# Altium project Samba2_Remote.PrjPcb
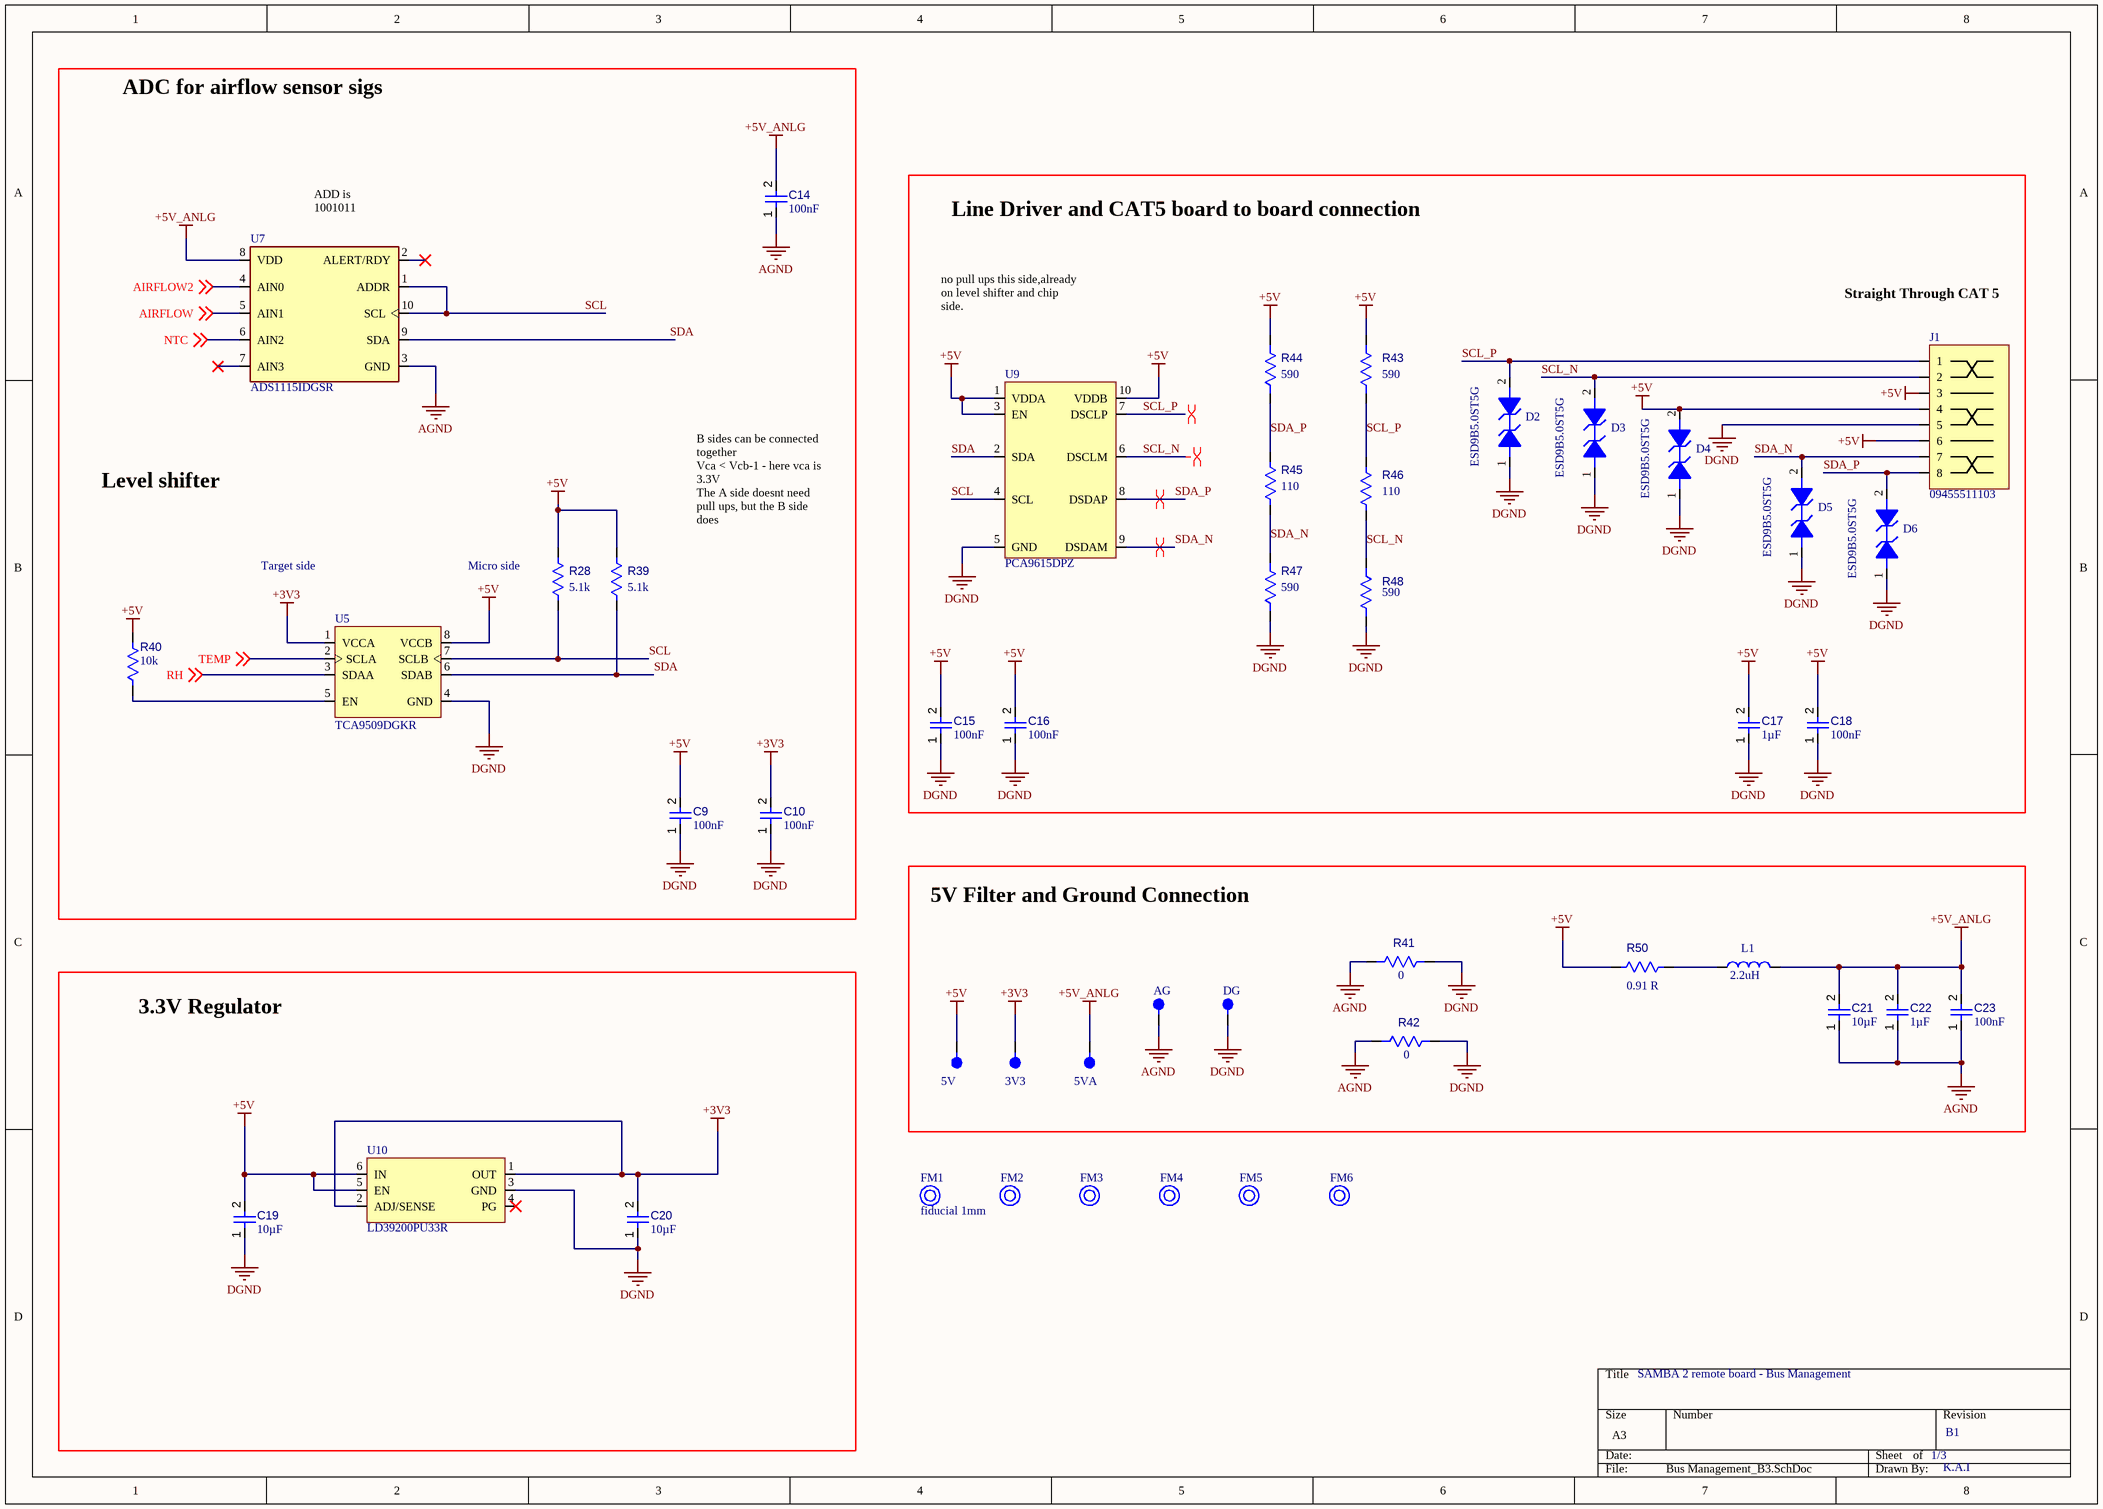
[diagram p0: Bus Management_B3.SchDoc]
Revision: B1
3 sheets, 95 parts. Net scope: global (net labels, ports and power ports of the same name join across sheets).
Board files: Remote Rev B3.PcbDoc, PCB1.PcbDoc
Sheets:
  Bus Management_B3.SchDoc
  Airspeed2_B3.SchDoc
  Airspeed1_B3.SchDoc

## Sheet Bus Management_B3.SchDoc
size A3; SheetNumber: 1; SheetTotal: 3

### Parts
3V3  PH1-01-UA  [FP-PH1-01-UA-MFG]  (value not drawn)  (no BOM)
5V  PH1-01-UA  [FP-PH1-01-UA-MFG]  (value not drawn)  (no BOM)
5VA  PH1-01-UA  [FP-PH1-01-UA-MFG]  (value not drawn)  (no BOM)
AG  PH1-01-UA  [FP-PH1-01-UA-MFG]  (value not drawn)  (no BOM)
C9  value 100nF  [MANUF_CAP_0603]  (hidden comment: CC0603KRX7R7BB104)
C10  value 100nF  [MANUF_CAP_0603]  (hidden comment: CC0603KRX7R7BB104)
C14  value 100nF  [MANUF_CAP_0603]  (hidden comment: CC0603KRX7R7BB104)
C15  value 100nF  [MANUF_CAP_0603]  (hidden comment: CC0603KRX7R7BB104)
C16  value 100nF  [MANUF_CAP_0603]  (hidden comment: CC0603KRX7R7BB104)
C17  value 1µF  [MANUF_CAP_0603]  (hidden comment: CL10B105KA8NFNC)
C18  value 100nF  [MANUF_CAP_0603]  (hidden comment: CC0603KRX7R7BB104)
C19  value 10µF  [FP-CL21B106KOQNNNE-IPC_A]  (hidden comment: CL21B106KOQNNNE)
C20  value 10µF  [FP-CL21B106KOQNNNE-IPC_A]  (hidden comment: CL21B106KOQNNNE)
C21  value 10µF  [FP-GRM188-0_15-MFG]  (hidden comment: GRM188R61A106ME69D)
C22  value 1µF  [MANUF_CAP_0603]  (hidden comment: CL10B105KA8NFNC)
C23  value 100nF  [MANUF_CAP_0603]  (hidden comment: CC0603KRX7R7BB104)
D2  ESD9B5.0ST5G  [ONSC-SOD-923-2-514AB-01_V]
D3  ESD9B5.0ST5G  [ONSC-SOD-923-2-514AB-01_V]
D4  ESD9B5.0ST5G  [ONSC-SOD-923-2-514AB-01_V]
D5  ESD9B5.0ST5G  [ONSC-SOD-923-2-514AB-01_V]
D6  ESD9B5.0ST5G  [ONSC-SOD-923-2-514AB-01_V]
DG  PH1-01-UA  [FP-PH1-01-UA-MFG]  (value not drawn)  (no BOM)
FM1  fiducial 1mm  [fiducial 1mm-Footprint-1]  (no BOM)
FM2  fiducial 1mm  [fiducial 1mm-Footprint-1]  (value not drawn)  (no BOM)
FM3  fiducial 1mm  [fiducial 1mm-Footprint-1]  (value not drawn)  (no BOM)
FM4  fiducial 1mm  [fiducial 1mm-Footprint-1]  (value not drawn)  (no BOM)
FM5  fiducial 1mm  [fiducial 1mm-Footprint-1]  (value not drawn)  (no BOM)
FM6  fiducial 1mm  [fiducial 1mm-Footprint-1]  (value not drawn)  (no BOM)
J1  09455511103  [09455511103-Footprint-1]
L1  value 2.2uH  [INDC3225X06N]  (hidden comment: CC322522A-2R2K)
R28  value 5.1k  [0805]  (hidden comment: RC0805JR-075K1L)
R39  value 5.1k  [0805]  (hidden comment: RC0805JR-075K1L)
R40  value 10k  [MANUF_RES_0603]  (hidden comment: RC0603FR-0710KL)
R41  value 0  [MANUF_RES_0603]  (hidden comment: Resistor 0R +/- 5% 0603 100 mW)
R42  value 0  [MANUF_RES_0603]  (hidden comment: Resistor 0R +/- 5% 0603 100 mW)
R43  value 590  [MANUF_RES_0603]  (hidden comment: ERJ-3EKF5900V)
R44  value 590  [MANUF_RES_0603]  (hidden comment: ERJ-3EKF5900V)
R45  value 110  [MANUF_RES_0603]  (hidden comment: RMCF0603FT110R)
R46  value 110  [MANUF_RES_0603]  (hidden comment: RMCF0603FT110R)
R47  value 590  [MANUF_RES_0603]  (hidden comment: ERJ-3EKF5900V)
R48  value 590  [MANUF_RES_0603]  (hidden comment: ERJ-3EKF5900V)
R50  value 0.91 R  [RESC3116X06N]  (hidden comment: CRM1206-FX-R910ELF)
U5  TCA9509DGKR  [TSOP65P490X110-8N]
U7  ADS1115IDGSR  [FP-DGS0010A-MFG]
U9  PCA9615DPZ  [TSSOP50P490X110-10N]
U10  LD39200PU33R  [FP-DFN6-7946637-MFG]

### Blocks framed on the sheet
Line Driver and CAT5 board to board connection: C15-C18 D2-D6 J1 R43-R48 U9
5V Filter and Ground Connection: 3V3 5V 5VA AG C21-C23 DG L1 R41 R42 R50
3.3V Regulator: C19 C20 U10

### Nets
+3V3: 3V3.1 C10.2 C20.2 U5.1(VCCA) U10.1(OUT) U10.2(ADJ/SENSE)
+5V: 5V.1 C9.2 C15.2 C16.2 C17.2 C18.2 C19.2 D4.2(A2) J1.3 J1.4 J1.6 R28.2 R39.2 R40.2 R43.2 R44.2 R50.1 U5.8(VCCB) U9.1(VDDA) U9.3(EN) U9.10(VDDB) U10.5(EN) U10.6(IN)
+5V_ANLG: 5VA.1 C14.2 C21.2 C22.2 C23.2 L1.2 U7.8(VDD)
AGND: AG.1 C14.1 C21.1 C22.1 C23.1 R41.1 R42.1 U7.3(GND)
DGND: C9.1 C10.1 C15.1 C16.1 C17.1 C18.1 C19.1 C20.1 D2.1(A1) D3.1(A1) D4.1(A1) D5.1(A1) D6.1(A1) DG.1 J1.5 R41.2 R42.2 R47.1 R48.1 U5.4(GND) U9.5(GND) U10.3(GND)
AIRFLOW: U7.5(AIN1) ; off-sheet AIRFLOW
AIRFLOW2: U7.4(AIN0) ; off-sheet AIRFLOW2
NTC: U7.6(AIN2) ; off-sheet NTC
RH: U5.3(SDAA) ; off-sheet RH
SCL: R28.1 U5.7(SCLB) U7.1(ADDR) U7.10(SCL) U9.4(SCL)
SCL_N: D3.2(A2) J1.2 R46.1 R48.2 U9.6(DSCLM)
SCL_P: D2.2(A2) J1.1 R43.1 R46.2 U9.7(DSCLP)
SDA: R39.1 U5.6(SDAB) U7.9(SDA) U9.2(SDA)
SDA_N: D5.2(A2) J1.7 R45.1 R47.2 U9.9(DSDAM)
SDA_P: D6.2(A2) J1.8 R44.1 R45.2 U9.8(DSDAP)
TEMP: U5.2(SCLA) ; off-sheet TEMP
NetL1_1: L1.1 R50.2
NetR40_1: R40.1 U5.5(EN)

Not connected (* = marked no-connect by the designer): U7 2(ALERT/RDY)* 7(AIN3)*; U10 4(PG)*

### Layout directives
differential pair: SCL_N, SCL_P, SDA_N, SDA_P

### Notes on the sheet
- ADC for airflow sensor sigs
- (near U7) ADD is
  1001011
- no pull ups this side,already on level shifter and chip side.
- Straight Through CAT 5
- Level shifter
- Target side
- (near R28) Micro side
- B sides can be connected together
  Vca < Vcb-1 - here vca is 3.3V
  The A side doesnt need pull ups, but the B side does
- SAMBA 2 remote board - Bus Management
- 1/3
- B1
- K.A.I

### Library data of the parts
3V3 5V 5VA AG DG = CMP-002-00083-1: Conn Unshrouded Header HDR 1 POS 2.54mm Solder ST Thru-Hole Bag
C9 C10 C14-C16 C18 C23 = CMP-001-00099-4: Ceramic Capacitor, Multilayer, Ceramic, 16V, 10% +Tol, 10% -Tol, X7R, 15% TC, 0.1uF, Surface Mount, 0603; Pins: 2; Min Operating Temperature: -55°C; Max Operating Temperature: 125°C; Case/Package: 0603; RoHS Compliant: Yes; Mounting Technology: Surface Mount; Capacitor Type: Ceramic
C17 C22 = CMP-001-00098-2: Ceramic Capacitor, Multilayer, Ceramic, 25V, 10% +Tol, 10% -Tol, X7R, 15% TC, 1uF, Surface Mount, 0603; Pins: 2; Mounting Technology: Surface Mount; Min Operating Temperature: -55°C; Case/Package: 0603; Capacitor Type: Ceramic; RoHS Compliant: Yes; Max Operating Temperature: 125°C
C19 C20 = CMP-001-00101-1: Ceramic Capacitor, Multilayer, Ceramic, 16V, 10% +Tol, 10% -Tol, X7R, 15% TC, 10uF, Surface Mount, 0805; RoHS Compliant: Yes; Max Operating Temperature: 125°C; Capacitor Type: Ceramic; Pins: 2; Min Operating Temperature: -55°C; Case/Package: 0805; Mounting Technology: Surface Mount
C21 = CMP-001-00097-1: Ceramic Capacitor, Multilayer, Ceramic, 10V, 20% +Tol, 20% -Tol, X5R, 15% TC, 10uF, Surface Mount, 0603; Min Operating Temperature: -55°C; RoHS Compliant: Yes; Pins: 2; Capacitor Type: Ceramic; Max Operating Temperature: 85°C; Mounting Technology: Surface Mount; Case/Package: 0603
D2-D6 = CMP-004-00032-1: Trans Voltage Suppressor Diode, 5V V(RWM), Bidirectional, 1 Element, Silicon; Pins: 2; Max Operating Temperature: 150°C; RoHS Compliant: Yes; Min Operating Temperature: -55°C
FM1-FM6 = CMP-00030-00004-9: fiducial marker 2D
J1 = CMP-002-00071-6: Telecom and Datacom Connector, 8 Contact(s), Female, Straight, Solder Terminal, Locking, Jack; Mounting Technology: Board; RoHS Compliant: Yes; Max Operating Temperature: 70°C; Min Operating Temperature: -40°C; Connector Type: TELECOM AND DATACOM CONNECTOR
L1 = CMP-006-00022-2: General Purpose Inductor, 2.2uH, 10%, 1 Element, Ferrite-Core, SMD, 1110; RoHS Compliant: Yes
R28 R39 = CMP-009-00191-2: Fixed Resistor, Metal Glaze/thick Film, 0.125W, 5100ohm, 150V, 5% +/-Tol, 100ppm/Cel, Surface Mount, 0805; Power: 125mW; Min Operating Temperature: -55°C; Case/Package: 0805; Pins: 2; Max Operating Temperature: 155°C; Tolerance: 5%; Mounting Technology: Surface Mount; RoHS Compliant: Yes
R40 = CMP-009-00204-2: Fixed Resistor, Metal Glaze/thick Film, 0.1W, 10000ohm, 75V, 1% +/-Tol, 100ppm/Cel, Surface Mount, 0603; Power: 100mW; Pins: 2; Max Operating Temperature: 155°C; Case/Package: 0603; RoHS Compliant: Yes; Tolerance: 1%; Min Operating Temperature: -55°C; Mounting Technology: Surface Mount
R41 R42 = CMP-009-00006-8: Chip Resistor, 0 Ohm, 0.1 W, -55 to 155 degC, 0603 (1608 Metric); Power: 100mW; Voltage Rating: 50V; Max Operating Temperature: 155°C; RoHS Compliant: True; Mounting Technology: SM; Case/Package: 0603; Min Operating Temperature: -55°C; Tolerance: 5%; Pins: 2
R43 R44 R47 R48 = CMP-009-00193-4: Fixed Resistor, Metal Glaze/thick Film, 0.1W, 590ohm, 75V, 1% +/-Tol, 100ppm/Cel, Surface Mount, 0603; Power: 100mW; Tolerance: 1%; Pins: 2; Mounting Technology: Surface Mount; Max Operating Temperature: 155°C; Min Operating Temperature: -55°C; RoHS Compliant: Yes; Case/Package: 0603
R45 R46 = CMP-009-00194-4: Fixed Resistor, Metal Glaze/thick Film, 0.1W, 110ohm, 75V, 1% +/-Tol, 100ppm/Cel, Surface Mount, 0603; Power: 100mW; Tolerance: 1%; Min Operating Temperature: -55°C; Case/Package: 0603; RoHS Compliant: Yes; Pins: 2; Mounting Technology: Surface Mount; Max Operating Temperature: 155°C
R50 = CMP-009-00211-1: Fixed Resistor, Metal Glaze/thick Film, 0.5W, 0.91ohm, 0.675V, 1% +/-Tol, 100ppm/Cel, Surface Mount, 1206; Power: 500mW; Mounting Technology: Surface Mount; RoHS Compliant: Yes; Min Operating Temperature: -55°C; Pins: 2; Case/Package: 1206; Tolerance: 1%; Max Operating Temperature: 155°C
U5 = CMP-00024-00006-2: Interface Circuit, PDSO8; Pins: 8; Case/Package: TSSOP; Min Operating Temperature: -40°C; RoHS Compliant: Yes; Max Operating Temperature: 85°C
U7 = CMP-015-00008-1: ADC, Delta-Sigma, 16-Bit, 1 Func, 4 Channel, Serial Access, PDSO10; Nominal Supply Voltage: 3.3V; Min Operating Temperature: -40°C; Max Operating Temperature: 125°C; RoHS Compliant: Yes; Case/Package: TSSOP; Pins: 10
U9 = CMP-00024-00007-3: IC Redriver I2C 2CH 10TSSOP
U10 = CMP-019-00050-2: Fixed Positive LDO Regulator, 3.3V, 0.25V Dropout; Max Supply Voltage: 6V; Case/Package: HVSON; Pins: 6; RoHS Compliant: Yes

## Sheet Airspeed2_B3.SchDoc
size A3; SheetNumber: 2; SheetTotal: 3
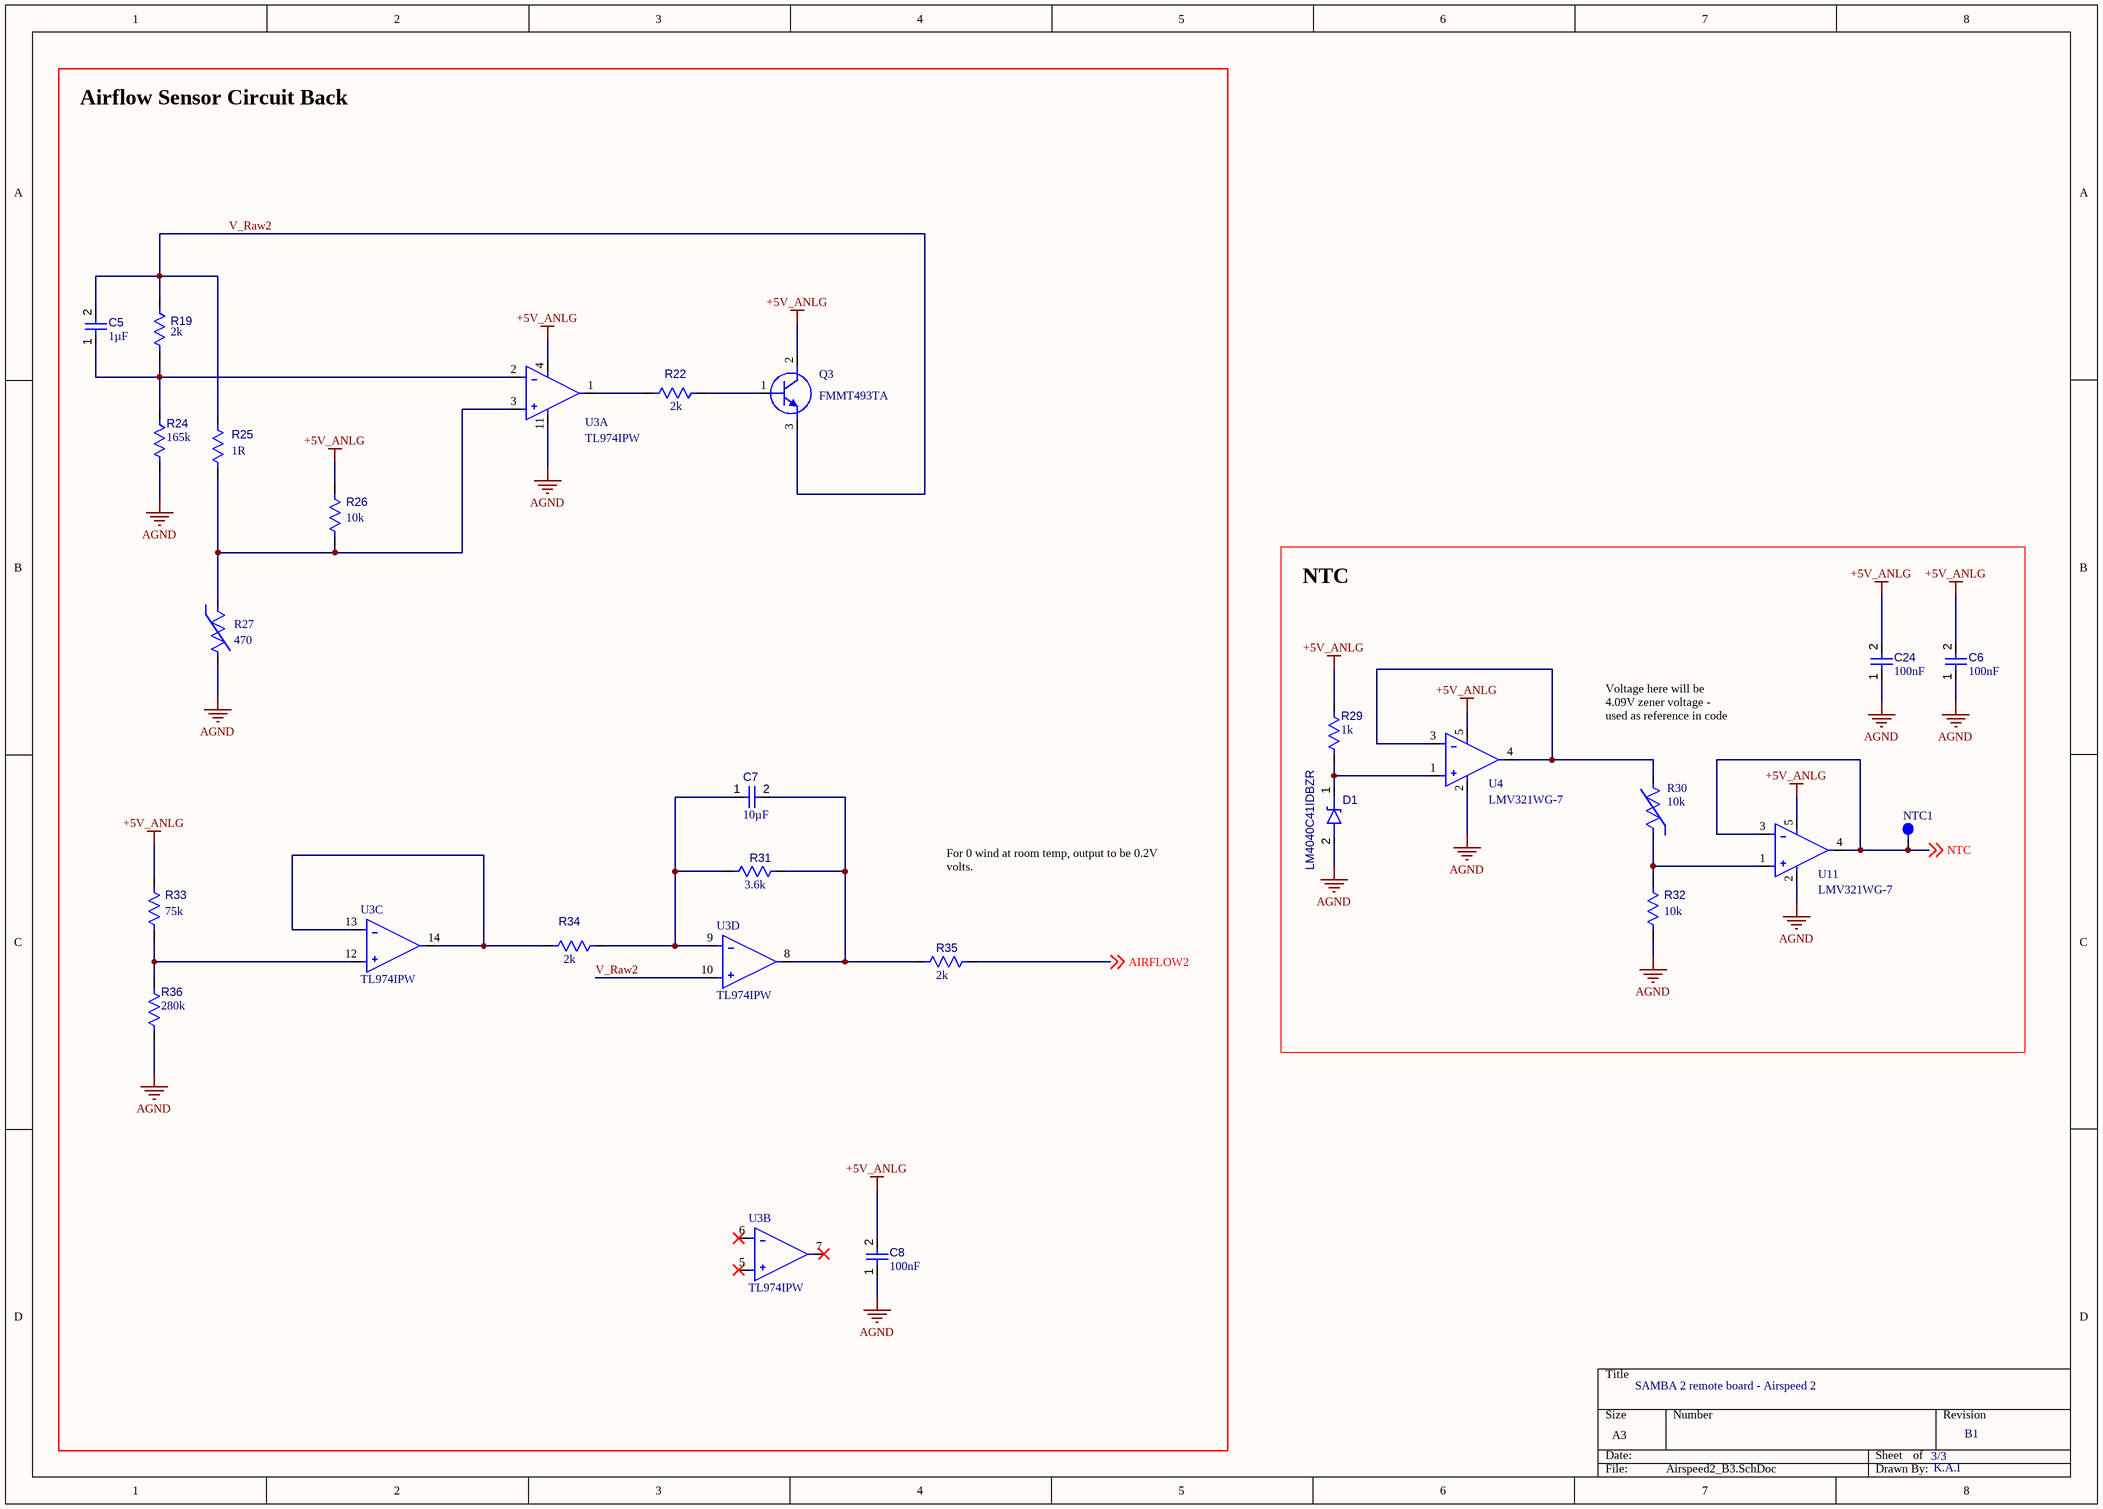
[diagram p1: Airspeed2_B3.SchDoc]

### Parts
C5  value 1µF  [MANUF_CAP_0603]  (hidden comment: CL10B105KA8NFNC)
C6  value 100nF  [MANUF_CAP_0603]  (hidden comment: CC0603KRX7R7BB104)
C7  value 10µF  [FP-GRM188-0_15-MFG]  (hidden comment: GRM188R61A106ME69D)
C8  value 100nF  [MANUF_CAP_0603]  (hidden comment: CC0603KRX7R7BB104)
C24  value 100nF  [MANUF_CAP_0603]  (hidden comment: CC0603KRX7R7BB104)
D1  LM4040C41IDBZR  [DBZ0003A_M]
NTC1  PH1-01-UA  [FP-PH1-01-UA-MFG]  (value not drawn)  (no BOM)
Q3  FMMT493TA  [SOT95P237X110-3N]
R19  value 2k  [MANUF_RES_0603]  (hidden comment: ERJ-3EKF2001V)
R22  value 2k  [MANUF_RES_0603]  (hidden comment: ERJ-3EKF2001V)
R24  value 165k  [RESC1608X55X30NL15T15]  (hidden comment: ERJ-3EKF1653V)
R25  value 1R  [Vishay_CRCW0805-HPe3_MFG]  (hidden comment: CRCW08051R00FKEAHP)
R26  value 10k  [MANUF_RES_0603]  (hidden comment: RC0603FR-0710KL)
R27  value 470  [NTCG103NH471JT1-Footprint-1]  (hidden comment: NTCG103NH471JT1)
R29  value 1k  [RESC1608X55X25ML10T15]  (hidden comment: Resistor 1k +/-1% 0603 100 mW)
R30  value 10k  [TT7-10KC3-11-Footprint-1]  (hidden comment: TT7-10KC3-11)
R31  value 3.6k  [RESC1609X50X30NL08T20]  (hidden comment: CRCW06033K60FKEAC)
R32  value 10k  [MANUF_RES_0603]  (hidden comment: RC0603FR-0710KL)
R33  value 75k  [IPC B 0603 RES]  (hidden comment: AC0603FR-0775KL)
R34  value 2k  [MANUF_RES_0603]  (hidden comment: ERJ-3EKF2001V)
R35  value 2k  [MANUF_RES_0603]  (hidden comment: ERJ-3EKF2001V)
R36  value 280k  [IPC B 0603 RES]  (hidden comment: RC0603FR-07280KL)
U3  TL974IPW  [TSOP65P640X120-14N]  (parts A,B,C,D of 4)
U4  LMV321WG-7  [SOT95P285X130-5N]
U11  LMV321WG-7  [SOT95P285X130-5N]

### Blocks framed on the sheet
Airflow Sensor Circuit Back: C5 C7 C8 Q3 R19 R22 R24-R27 R31 R33-R36 U3
NTC: C6 C24 D1 NTC1 R29 R30 R32 U4 U11

### Nets
+5V_ANLG: C6.2 C8.2 C24.2 Q3.2(C) R26.2 R29.2 R33.2 U3.4(VDD) U4.5(VDD) U11.5(VDD)
AGND: C6.1 C8.1 C24.1 D1.2(A) R24.1 R27.2 R32.1 R36.1 U3.11(VSS) U4.2(VSS) U11.2(VSS)
AIRFLOW2: R35.1 ; off-sheet AIRFLOW2
NTC: NTC1.1 U11.3(-IN) U11.4(OUT) ; off-sheet NTC
V_Raw2: C5.2 Q3.3(E) R19.2 R25.2 U3.10(+IN_C)
NetC5_1: C5.1 R19.1 R24.2 U3.2(-IN_A)
NetC7_1: C7.1 R31.1 R34.1 U3.9(-IN_C)
NetC7_2: C7.2 R31.2 R35.2 U3.8(OUT_C)
NetD1_1: D1.1(K) R29.1 U4.1(+IN)
NetQ3_1: Q3.1(B) R22.1
NetR22_2: R22.2 U3.1(OUT_A)
NetR25_1: R25.1 R26.1 R27.1 U3.3(+IN_A)
NetR30_1: R30.1 R32.2 U11.1(+IN)
NetR30_2: R30.2 U4.3(-IN) U4.4(OUT)
NetR33_1: R33.1 R36.2 U3.12(+IN_D)
NetR34_2: R34.2 U3.13(-IN_D) U3.14(OUT_D)

Not connected (* = marked no-connect by the designer): U3 5(+IN_B)* 6(-IN_B)* 7(OUT_B)*

### Notes on the sheet
- (near R30) Voltage here will be 4.09V zener voltage - used as reference in code
- For 0 wind at room temp, output to be 0.2V volts.
- SAMBA 2 remote board - Airspeed 2
- 3/3
- B1
- K.A.I

### Library data of the parts
C5 = CMP-001-00098-2: as C17 on sheet Bus Management_B3; Pins: 2; Mounting Technology: Surface Mount; Min Operating Temperature: -55°C; Case/Package: 0603; Capacitor Type: Ceramic; RoHS Compliant: Yes; Max Operating Temperature: 125°C
C6 C8 C24 = CMP-001-00099-4: as C9 on sheet Bus Management_B3; Pins: 2; Min Operating Temperature: -55°C; Max Operating Temperature: 125°C; Case/Package: 0603; RoHS Compliant: Yes; Mounting Technology: Surface Mount; Capacitor Type: Ceramic
C7 = CMP-001-00097-1: as C21 on sheet Bus Management_B3; Min Operating Temperature: -55°C; RoHS Compliant: Yes; Pins: 2; Capacitor Type: Ceramic; Max Operating Temperature: 85°C; Mounting Technology: Surface Mount; Case/Package: 0603
D1 = CMP-004-00033-2: Two Terminal Voltage Reference, 1 Output, 4.096V, BIPolar, PDSO3; Pins: 3; Case/Package: TSSOP; Max Operating Temperature: 85°C; Min Operating Temperature: -40°C; RoHS Compliant: Yes
NTC1 = CMP-002-00083-1: as 3V3 on sheet Bus Management_B3
Q3 = CMP-013-00034-1: Small Signal Bipolar Transistor, 1A I(C), 100V V(BR)CEO, 1-Element, NPN, Silicon; Frequency: 150MHz; Max Operating Temperature: 150°C; RoHS Compliant: Yes; Pins: 3
R19 R22 R34 R35 = CMP-009-00207-2: Fixed Resistor, Metal Glaze/thick Film, 0.1W, 2000ohm, 75V, 1% +/-Tol, 100ppm/Cel, Surface Mount, 0603; Power: 100mW; RoHS Compliant: Yes; Pins: 2; Max Operating Temperature: 155°C; Case/Package: 0603; Tolerance: 1%; Mounting Technology: Surface Mount; Min Operating Temperature: -55°C
R24 = CMP-009-00209-1: Fixed Resistor, Metal Glaze/thick Film, 0.1W, 165000ohm, 75V, 1% +/-Tol, 100ppm/Cel, Surface Mount, 0603; Power: 100mW; Pins: 2; RoHS Compliant: Yes; Mounting Technology: Surface Mount; Min Operating Temperature: -55°C; Max Operating Temperature: 155°C; Case/Package: 0603; Tolerance: 1%
R25 = CMP-009-00205-1: Fixed Resistor, Metal Glaze/thick Film, 0.5W, 1ohm, 150V, 1% +/-Tol, 100ppm/Cel, Surface Mount, 0805; Power: 500mW; Pins: 2; Max Operating Temperature: 155°C; Mounting Technology: Surface Mount; RoHS Compliant: Yes; Min Operating Temperature: -55°C; Case/Package: 0805; Tolerance: 1%
R26 R32 = CMP-009-00204-2: as R40 on sheet Bus Management_B3; Pins: 2; Max Operating Temperature: 155°C; Case/Package: 0603; RoHS Compliant: Yes; Tolerance: 1%; Min Operating Temperature: -55°C; Mounting Technology: Surface Mount
R27 = CMP-009-00192-3: NTC Thermistor, 470ohm, Surface Mount; Tolerance: 5%; Power: 100mW; RoHS Compliant: Yes; Pins: 2; Min Operating Temperature: -40°C; Max Operating Temperature: 125°C; Mounting Technology: Surface Mount
R29 = CMP-009-00014-6: Chip Resistor, 1 KOhm, +/-1%, 0.1 W, -55 to 155 degC, 0603 (1608 Metric); Tolerance: 1%; Power: 100mW; Voltage Rating: 50V; Pins: 2; Min Operating Temperature: -55°C; Mounting Technology: SM; Max Operating Temperature: 155°C; Case/Package: 0603; RoHS Compliant: True
R30 = CMP-009-00210-1: Lead Frame Ntc 10K 1 Ohm B TT7 3977K; Tolerance: 1%; Case/Package: Through hole
R31 = CMP-009-00200-1: Fixed Resistor, Metal Glaze/thick Film, 0.1W, 3600ohm, 75V, 1% +/-Tol, 100ppm/Cel, Surface Mount, 0603; Power: 100mW; Case/Package: 0603; Min Operating Temperature: -55°C; RoHS Compliant: Yes; Pins: 2; Tolerance: 1%; Max Operating Temperature: 155°C
R33 = CMP-009-00208-1: Fixed Resistor, Metal Glaze/thick Film, 0.1W, 75000ohm, 75V, 1% +/-Tol, 100ppm/Cel, Surface Mount, 0603; Power: 100mW; Max Operating Temperature: 155°C; Tolerance: 1%; Min Operating Temperature: -55°C; Case/Package: 0603; Mounting Technology: Surface Mount; RoHS Compliant: Yes; Pins: 2
R36 = CMP-009-00212-1: Fixed Resistor, Metal Glaze/thick Film, 0.1W, 280000ohm, 75V, 1% +/-Tol, 100ppm/Cel, Surface Mount, 0603; Power: 100mW; Max Operating Temperature: 155°C; Tolerance: 1%; Pins: 2; Case/Package: 0603; Mounting Technology: Surface Mount; RoHS Compliant: Yes; Min Operating Temperature: -55°C
U3 = CMP-014-00004-4: Operational Amplifier, 4 Func, 6000uV Offset-Max, BIPolar, PDSO14; Nominal Supply Voltage: 2.5V; Channels: 4; Max Operating Temperature: 125°C; RoHS Compliant: Yes; Pins: 14; Case/Package: TSSOP; Min Operating Temperature: -40°C
U4 U11 = CMP-014-00005-1: Operational Amplifier, 1 Func, 9000uV Offset-Max, CMOS, PDSO5; Channels: 1; Nominal Supply Voltage: 2.7V; Min Operating Temperature: -40°C; Pins: 5; Max Operating Temperature: 85°C; Case/Package: LSSOP; RoHS Compliant: Yes

## Sheet Airspeed1_B3.SchDoc
size A3; SheetNumber: 3; SheetTotal: 3
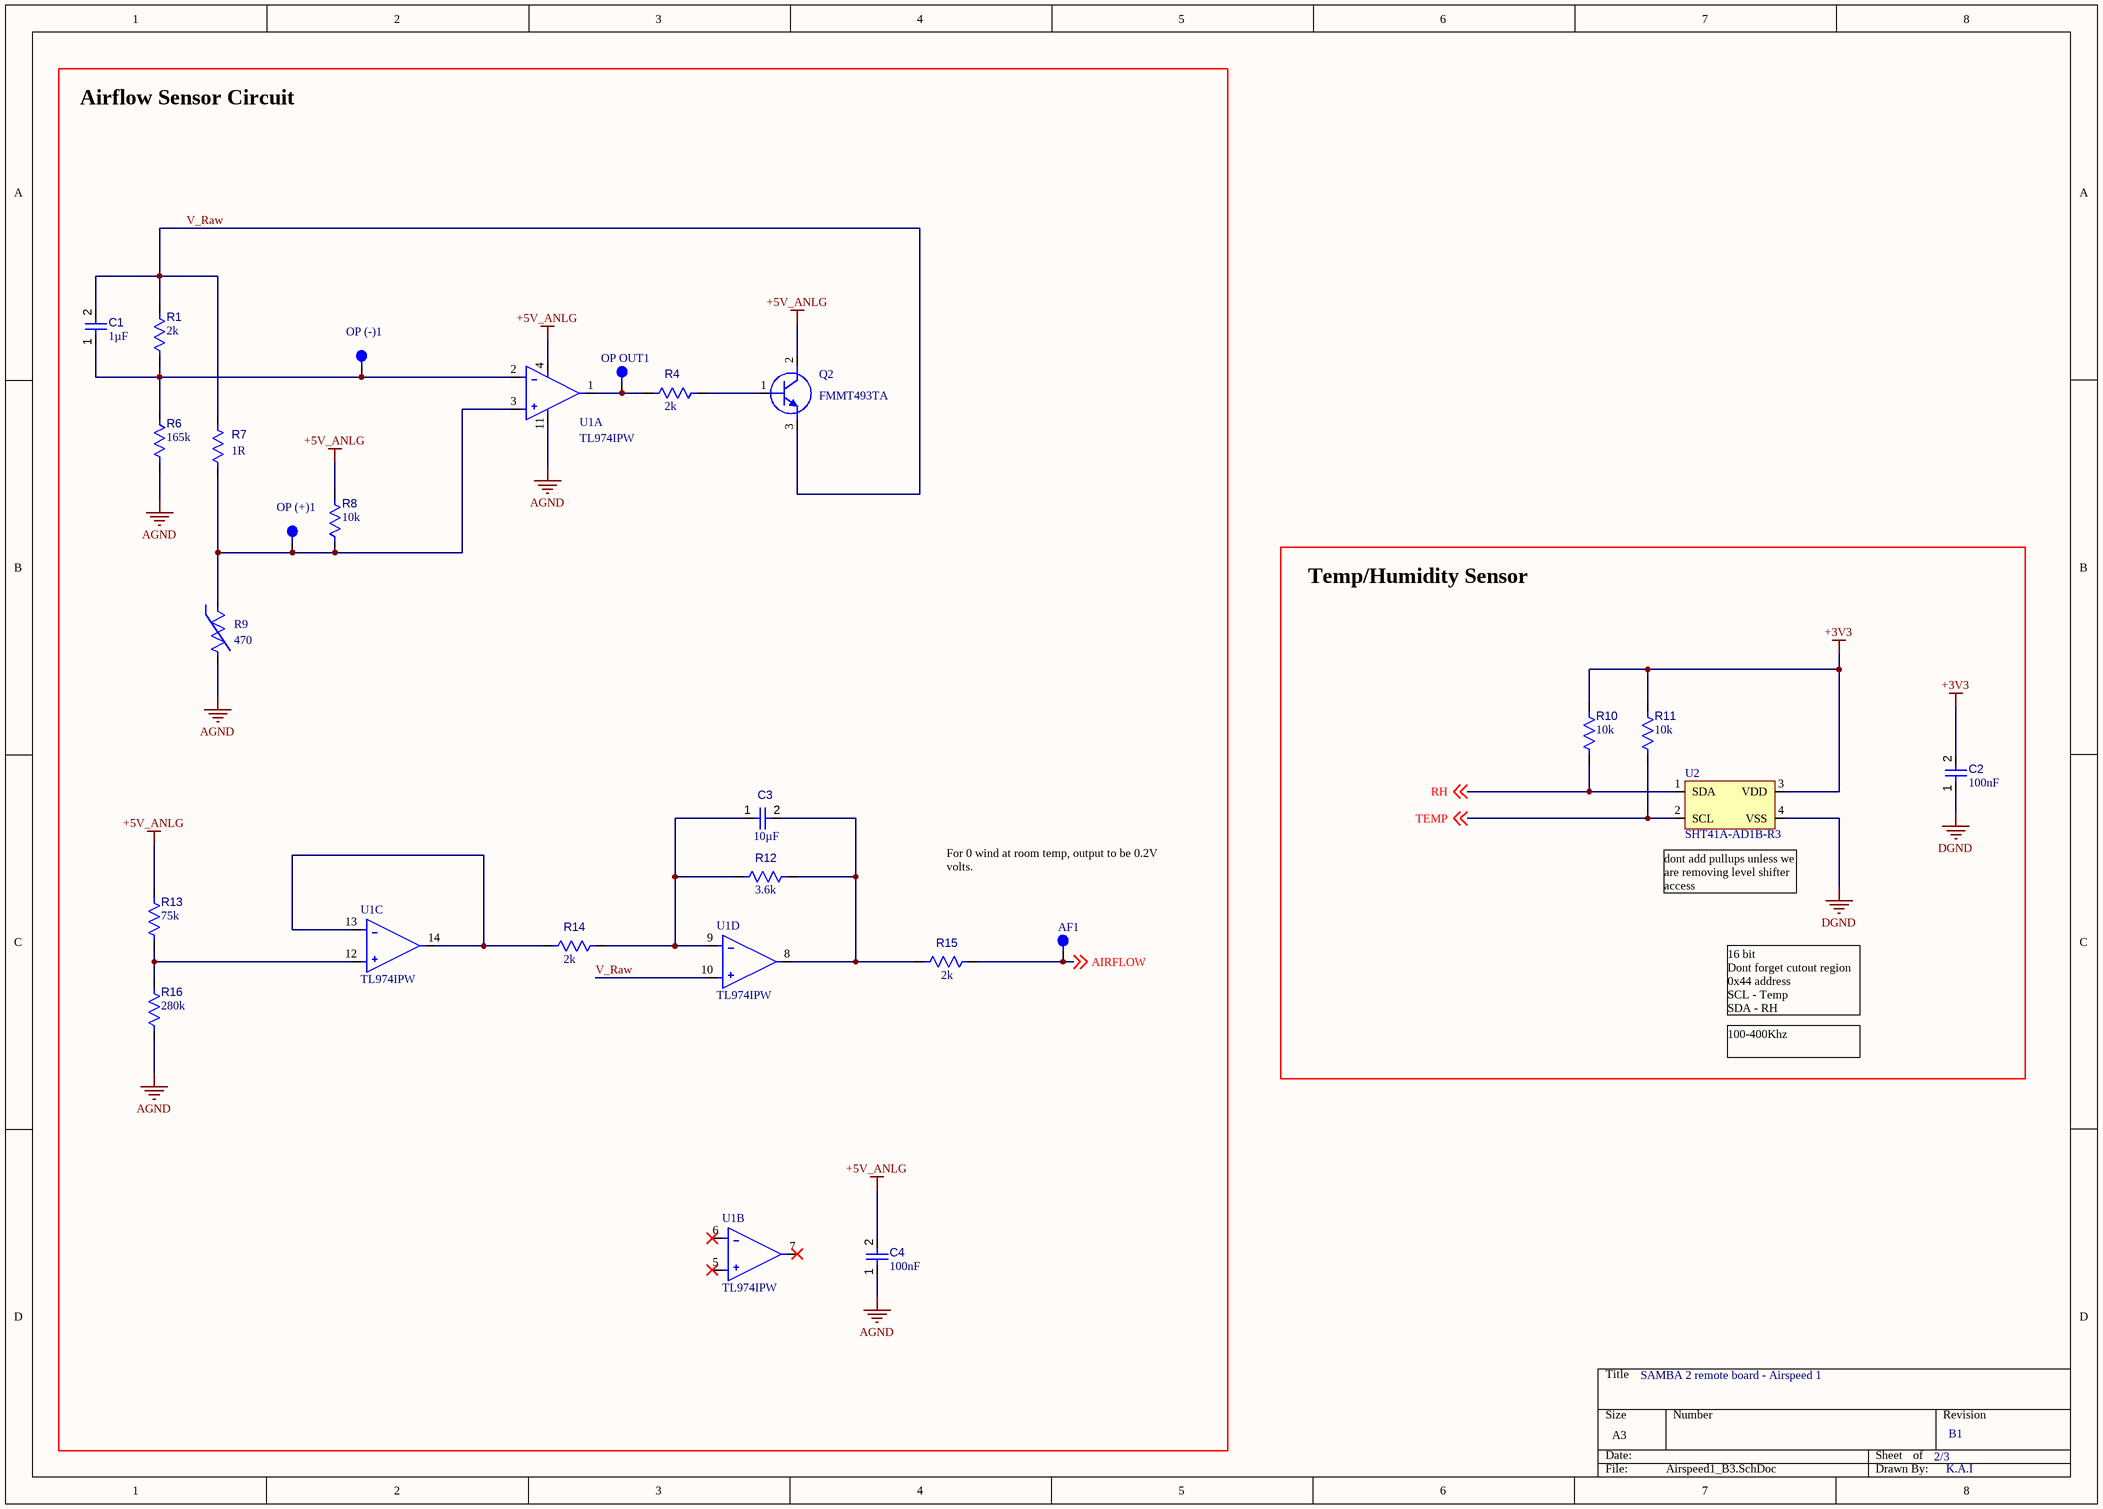
[diagram p2: Airspeed1_B3.SchDoc]

### Parts
AF1  PH1-01-UA  [FP-PH1-01-UA-MFG]  (value not drawn)  (no BOM)
C1  value 1µF  [MANUF_CAP_0603]  (hidden comment: CL10B105KA8NFNC)
C2  value 100nF  [MANUF_CAP_0603]  (hidden comment: CC0603KRX7R7BB104)
C3  value 10µF  [FP-GRM188-0_15-MFG]  (hidden comment: GRM188R61A106ME69D)
C4  value 100nF  [MANUF_CAP_0603]  (hidden comment: CC0603KRX7R7BB104)
OP_(+)1  PH1-01-UA  [FP-PH1-01-UA-MFG]  (value not drawn)  (no BOM)
OP_(-)1  PH1-01-UA  [FP-PH1-01-UA-MFG]  (value not drawn)  (no BOM)
OP_OUT1  PH1-01-UA  [FP-PH1-01-UA-MFG]  (value not drawn)  (no BOM)
Q2  FMMT493TA  [SOT95P237X110-3N]
R1  value 2k  [MANUF_RES_0603]  (hidden comment: ERJ-3EKF2001V)
R4  value 2k  [MANUF_RES_0603]  (hidden comment: ERJ-3EKF2001V)
R6  value 165k  [RESC1608X55X30NL15T15]  (hidden comment: ERJ-3EKF1653V)
R7  value 1R  [Vishay_CRCW0805-HPe3_MFG]  (hidden comment: CRCW08051R00FKEAHP)
R8  value 10k  [MANUF_RES_0603]  (hidden comment: RC0603FR-0710KL)
R9  value 470  [NTCG103NH471JT1-Footprint-1]  (hidden comment: NTCG103NH471JT1)
R10  value 10k  [MANUF_RES_0603]  (hidden comment: RC0603FR-0710KL)
R11  value 10k  [MANUF_RES_0603]  (hidden comment: RC0603FR-0710KL)
R12  value 3.6k  [RESC1609X50X30NL08T20]  (hidden comment: CRCW06033K60FKEAC)
R13  value 75k  [IPC B 0603 RES]  (hidden comment: AC0603FR-0775KL)
R14  value 2k  [MANUF_RES_0603]  (hidden comment: ERJ-3EKF2001V)
R15  value 2k  [MANUF_RES_0603]  (hidden comment: ERJ-3EKF2001V)
R16  value 280k  [IPC B 0603 RES]  (hidden comment: RC0603FR-07280KL)
U1  TL974IPW  [TSOP65P640X120-14N]  (parts A,B,C,D of 4)
U2  SHT41A-AD1B-R3  [SHT41A-AD1B-R3-Footprint-1]

### Blocks framed on the sheet
Airflow Sensor Circuit: AF1 C1 C3 C4 OP_(+)1 OP_(-)1 OP_OUT1 Q2 R1 R4 R6-R9 R12-R16 U1
Temp/Humidity Sensor: C2 R10 R11 U2

### Nets
+3V3: C2.2 R10.2 R11.2 U2.3(VDD)
+5V_ANLG: C4.2 Q2.2(C) R8.2 R13.2 U1.4(VDD)
AGND: C4.1 R6.1 R9.2 R16.1 U1.11(VSS)
DGND: C2.1 U2.4(VSS)
AIRFLOW: AF1.1 R15.1 ; off-sheet AIRFLOW
RH: R10.1 U2.1(SDA) ; off-sheet RH
TEMP: R11.1 U2.2(SCL) ; off-sheet TEMP
V_Raw: C1.2 Q2.3(E) R1.2 R7.2 U1.10(+IN_C)
NetC1_1: C1.1 OP_(-)1.1 R1.1 R6.2 U1.2(-IN_A)
NetC3_1: C3.1 R12.1 R14.1 U1.9(-IN_C)
NetC3_2: C3.2 R12.2 R15.2 U1.8(OUT_C)
NetOP_(+)1_1: OP_(+)1.1 R7.1 R8.1 R9.1 U1.3(+IN_A)
NetOP_OUT1_1: OP_OUT1.1 R4.2 U1.1(OUT_A)
NetQ2_1: Q2.1(B) R4.1
NetR13_1: R13.1 R16.2 U1.12(+IN_D)
NetR14_2: R14.2 U1.13(-IN_D) U1.14(OUT_D)

Not connected (* = marked no-connect by the designer): U1 5(+IN_B)* 6(-IN_B)* 7(OUT_B)*

### Notes on the sheet
- For 0 wind at room temp, output to be 0.2V volts.
- (near U2) dont add pullups unless we are removing level shifter access
- 16 bit
  Dont forget cutout region
  0x44 address
  SCL - Temp
  SDA - RH
- 100-400Khz
- SAMBA 2 remote board - Airspeed 1
- 2/3
- B1
- K.A.I

### Library data of the parts
AF1 OP_(+)1 OP_(-)1 OP_OUT1 = CMP-002-00083-1: as 3V3 on sheet Bus Management_B3
C1 = CMP-001-00098-2: as C17 on sheet Bus Management_B3; Pins: 2; Mounting Technology: Surface Mount; Min Operating Temperature: -55°C; Case/Package: 0603; Capacitor Type: Ceramic; RoHS Compliant: Yes; Max Operating Temperature: 125°C
C2 C4 = CMP-001-00099-4: as C9 on sheet Bus Management_B3; Pins: 2; Min Operating Temperature: -55°C; Max Operating Temperature: 125°C; Case/Package: 0603; RoHS Compliant: Yes; Mounting Technology: Surface Mount; Capacitor Type: Ceramic
C3 = CMP-001-00097-1: as C21 on sheet Bus Management_B3; Min Operating Temperature: -55°C; RoHS Compliant: Yes; Pins: 2; Capacitor Type: Ceramic; Max Operating Temperature: 85°C; Mounting Technology: Surface Mount; Case/Package: 0603
Q2 = CMP-013-00034-1: as Q3 on sheet Airspeed2_B3; Max Operating Temperature: 150°C; RoHS Compliant: Yes; Pins: 3
R1 R4 R14 R15 = CMP-009-00207-2: as R19 on sheet Airspeed2_B3; RoHS Compliant: Yes; Pins: 2; Max Operating Temperature: 155°C; Case/Package: 0603; Tolerance: 1%; Mounting Technology: Surface Mount; Min Operating Temperature: -55°C
R6 = CMP-009-00209-1: as R24 on sheet Airspeed2_B3; Pins: 2; RoHS Compliant: Yes; Mounting Technology: Surface Mount; Min Operating Temperature: -55°C; Max Operating Temperature: 155°C; Case/Package: 0603; Tolerance: 1%
R7 = CMP-009-00205-1: as R25 on sheet Airspeed2_B3; Pins: 2; Max Operating Temperature: 155°C; Mounting Technology: Surface Mount; RoHS Compliant: Yes; Min Operating Temperature: -55°C; Case/Package: 0805; Tolerance: 1%
R8 R10 R11 = CMP-009-00204-2: as R40 on sheet Bus Management_B3; Pins: 2; Max Operating Temperature: 155°C; Case/Package: 0603; RoHS Compliant: Yes; Tolerance: 1%; Min Operating Temperature: -55°C; Mounting Technology: Surface Mount
R9 = CMP-009-00192-3: as R27 on sheet Airspeed2_B3; RoHS Compliant: Yes; Pins: 2; Min Operating Temperature: -40°C; Max Operating Temperature: 125°C; Mounting Technology: Surface Mount
R12 = CMP-009-00200-1: as R31 on sheet Airspeed2_B3; Case/Package: 0603; Min Operating Temperature: -55°C; RoHS Compliant: Yes; Pins: 2; Tolerance: 1%; Max Operating Temperature: 155°C
R13 = CMP-009-00208-1: as R33 on sheet Airspeed2_B3; Max Operating Temperature: 155°C; Tolerance: 1%; Min Operating Temperature: -55°C; Case/Package: 0603; Mounting Technology: Surface Mount; RoHS Compliant: Yes; Pins: 2
R16 = CMP-009-00212-1: as R36 on sheet Airspeed2_B3; Max Operating Temperature: 155°C; Tolerance: 1%; Pins: 2; Case/Package: 0603; Mounting Technology: Surface Mount; RoHS Compliant: Yes; Min Operating Temperature: -55°C
U1 = CMP-014-00004-4: as U3 on sheet Airspeed2_B3; Max Operating Temperature: 125°C; RoHS Compliant: Yes; Pins: 14; Case/Package: TSSOP; Min Operating Temperature: -40°C
U2 = CMP-010-00024-1: Board Mount Humidity Sensors 4th Gen Humidity and Temperature Sensor

## Nets that join several sheets
+3V3: Bus Management_B3 (6 pins), Airspeed1_B3 (C2.2 R10.2 R11.2 U2.3)
+5V_ANLG: Bus Management_B3 (7 pins), Airspeed2_B3 (10 pins), Airspeed1_B3 (5 pins)
AGND: Bus Management_B3 (8 pins), Airspeed2_B3 (11 pins), Airspeed1_B3 (5 pins)
DGND: Bus Management_B3 (22 pins), Airspeed1_B3 (C2.1 U2.4)
AIRFLOW: Bus Management_B3 (U7.5), Airspeed1_B3 (AF1.1 R15.1)
AIRFLOW2: Bus Management_B3 (U7.4), Airspeed2_B3 (R35.1)
NTC: Bus Management_B3 (U7.6), Airspeed2_B3 (NTC1.1 U11.3 U11.4)
RH: Bus Management_B3 (U5.3), Airspeed1_B3 (R10.1 U2.1)
TEMP: Bus Management_B3 (U5.2), Airspeed1_B3 (R11.1 U2.2)

## Assembly variants
Samba2_Remote B3 Manuf: not fitted 3V3 5V 5VA AF1 AG BJT B1 BJT E1 D7 DG NTC1 OP (+)1 OP (-)1 OP OUT1 POT1 R10 R11 R49 VRAW1